# Altium schematic sheet Fonte_Sim_Bat.SchDoc
size A4; Author: Vitor Costa; DrawnBy: Vitor Costa
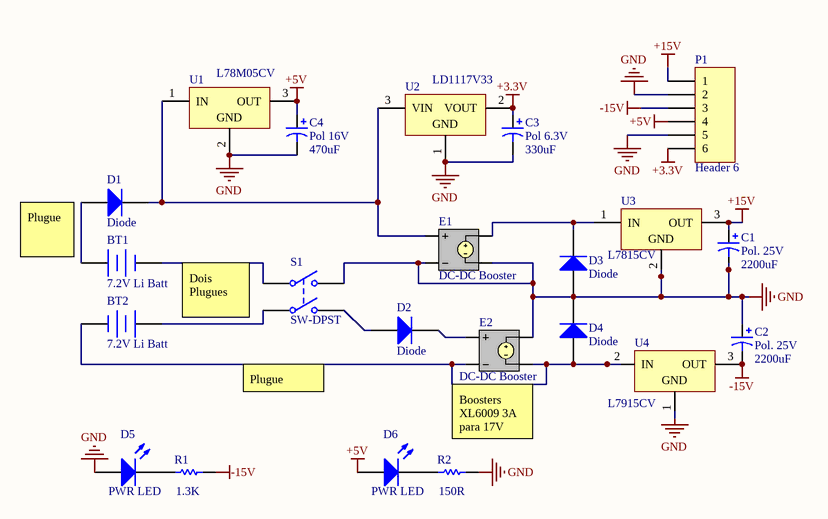
[diagram p0: Fonte_Sim_Bat.SchDoc]

## Parts
BT1  7.2V Li Batt  [BAT-2]
BT2  7.2V Li Batt  [BAT-2]
C1  Pol. 25V  value 2200uF  [RB7.6-15]
C2  Pol. 25V  value 2200uF  [RB7.6-15]
C3  Pol 6.3V  value 330uF  [RB7.6-15]
C4  Pol 16V  value 470uF  [RB7.6-15]
D1  Diode  [SMC]
D2  Diode  [SMC]
D3  Diode  [SMC]
D4  Diode  [SMC]
D5  PWR LED  [3.5X2.8X1.9]
D6  PWR LED  [3.5X2.8X1.9]
E1  DC-DC Booster
E2  DC-DC Booster
P1  Header 6  [HDR1X6]
R1  value 1.3K  [AXIAL-0.3]
R2  value 150R  [AXIAL-0.3]
S1  SW-DPST  [DPST-4]
U1  L78M05CV  [TO220]
U2  LD1117V33  [TO220]
U3  L7815CV  [TO220]
U4  L7915CV  [TO-220]

## Nets
+3.3V: C3.1 P1.6 U2.2(VOUT)
+5V: C4.1 D6.1(A) P1.4 U1.3(OUT)
+15V: C1.1 P1.1 U3.3(OUT)
-15V: C2.2 P1.3 R1.2 U4.3(OUT)
GND: C1.2 C2.1 C3.2 C4.2 D3.1(A) D4.2(K) D5.1(A) E1.2(NC-) E1.4(N-) E2.3(N+) P1.2 P1.5 R2.2 S1.2(NO1) U1.2(GND) U2.1(GND) U3.2(GND) U4.1(GND)
NetBT1_1: BT1.1(+) D1.1(A)
NetBT1_2: BT1.2(-) S1.1(COMMON1)
NetBT2_1: BT2.1(+) S1.3(COMMON2)
NetBT2_2: BT2.2(-) D4.1(A) E2.2(NC-) E2.4(N-) U4.2(IN)
NetD1_2: D1.2(K) E1.1(NC+) U1.1(IN) U2.3(VIN)
NetD2_1: D2.1(A) S1.4(NO2)
NetD2_2: D2.2(K) E2.1(NC+)
NetD3_2: D3.2(K) E1.3(N+) U3.1(IN)
NetD5_2: D5.2(K) R1.1
NetD6_2: D6.2(K) R2.1

## Notes on the sheet
- Plugue
- Dois Plugues
- Boosters XL6009 3A para 17V

## Library data of the parts
BT1 BT2 = Battery: Multicell Battery; Published: 24-Mar-1999; LatestRevisionDate: 17-Jul-2002; LatestRevisionNote: Re-released for DXP Platform.; PackageReference: BAT-2; Publisher: Altium Limited; PackageDescription: Battery; 2 Leads
C1-C4 = Cap Pol1: Polarized Capacitor (Radial); Published: 8-Jun-2000; LatestRevisionDate: 17-Jul-2002; LatestRevisionNote: Re-released for DXP Platform.; PackageReference: RB7.6-15; Publisher: Altium Limited; PackageDescription: Polarized Capacitor (Radial); 2 Leads
D1 D2 = Diode: 2A or greater, to prevent reverse polarity; Published: 8-Jun-2000; LatestRevisionDate: 17-Jul-2002; LatestRevisionNote: Re-released for DXP Platform.; PackageVersion: Sep-1996; PackageReference: SMC; Publisher: Altium Limited; PackageDescription: DO-214-AB/SMC; 2 C-Bend Leads; Body 7.9 x 5.9 mm, inc. leads (LxW); Code_JEDEC: DO-214-AB
D3 D4 = Diode: Flywheel; Published: 8-Jun-2000; LatestRevisionDate: 17-Jul-2002; LatestRevisionNote: Re-released for DXP Platform.; PackageVersion: Sep-1996; PackageReference: SMC; Publisher: Altium Limited; PackageDescription: DO-214-AB/SMC; 2 C-Bend Leads; Body 7.9 x 5.9 mm, inc. leads (LxW); Code_JEDEC: DO-214-AB
D5 D6 = LED3: Typical BLUE SiC LED; Published: 8-Jun-2000; LatestRevisionDate: 17-Dec-2003; LatestRevisionNote: PCB Footprint replaced.; DatasheetVersion: 16-Apr-2002; PackageVersion: 16-Apr-2002; PackageReference: 3.5X2.8X1.9; Publisher: Altium Limited; PackageDescription: SM LED; 2 C-Bend Leads; Body 3.5 x 2.8 x 1.9 mm, inc leads (LxWxH typ)
E1 E2 = ESRC: Voltage Controlled Voltage Source; Note: PCB Footprint - Not required; Sim Note: Enter gain into gain field; Published: 8-Jun-2000; LatestRevisionDate: 17-Jul-2002; LatestRevisionNote: Re-released for DXP Platform.; PackageReference: Not Applicable; Publisher: Altium Limited
P1 = Header 6: Header, 6-Pin; LatestRevisionDate: 17-Jul-2002; LatestRevisionNote: Re-released for DXP Platform.; Publisher: Altium Limited
R1 R2 = Res1: Resistor; Published: 8-Jun-2000; LatestRevisionDate: 17-Jul-2002; LatestRevisionNote: Re-released for DXP Platform.; PackageReference: AXIAL-0.3; Publisher: Altium Limited; PackageDescription: Axial Device, Thru-Hole; 2 Leads; 0.3 in Pin Spacing
S1 = SW-DPST: Double-Pole, Single-Throw Switch; Published: 24-Mar-1999; LatestRevisionDate: 17-Jul-2002; LatestRevisionNote: Re-released for DXP Platform.; PackageReference: DPST-4; Publisher: Altium Limited; PackageDescription: Switch; 4 Leads
U1 = L78M05CV: Positive Voltage Regulator, 5V, 3-Pin TO-220; DatasheetVersion: Nov-2010; PackageVersion: ver3.0; PackageReference: TO220; PackageDescription: TO, Thru-Hole, Vertical, Heatsink Mounted; 3 In-Line Leads; Pitch 2.54 mm; PartNumber: L78M05CV; ComponentLink1Description: Manufacturer URL; ComponentLink1URL: http://www.st.com; ComponentLink2Description: Datasheet; ComponentLink2URL: http://www.st.com/internet/com/TECHNICAL_RESOURCES/TECHNICAL_LITERATURE/DATASHEET/CD00000447.pdf; ComponentLink3Description: Package Specification; ComponentLink3URL: http://www.st.com/internet/com/TECHNICAL_RESOURCES/TECHNICAL_LITERATURE/PACKAGE_INFORMATION/CD00004649.pdf
U2 = LD1117V33: Fixed Low Drop Positive Voltage Regulator, 3.3V, 3-Pin TO-220; DatasheetVersion: Nov-2011; PackageVersion: ver3.0; PackageReference: TO220; PackageDescription: TO, Thru-Hole, Vertical, Heatsink Mounted; 3 In-Line Leads; Pitch 2.54 mm; PartNumber: LD1117V33; ComponentLink1Description: Manufacturer URL; ComponentLink1URL: http://www.st.com; ComponentLink2Description: Datasheet; ComponentLink2URL: http://www.st.com/internet/com/TECHNICAL_RESOURCES/TECHNICAL_LITERATURE/DATASHEET/CD00000544.pdf; ComponentLink3Description: Package Specification; ComponentLink3URL: http://www.st.com/internet/com/TECHNICAL_RESOURCES/TECHNICAL_LITERATURE/PACKAGE_INFORMATION/CD00004649.pdf
U3 = L7815CV: Positive Voltage Regulator, 15V, 3-Pin TO-220; DatasheetVersion: Nov-2011; PackageVersion: ver3.0; PackageReference: TO220; PackageDescription: TO, Thru-Hole, Vertical, Heatsink Mounted; 3 In-Line Leads; Pitch 2.54 mm; PartNumber: L7815CV; ComponentLink1Description: Manufacturer URL; ComponentLink1URL: http://www.st.com; ComponentLink2Description: Datasheet; ComponentLink2URL: http://www.st.com/internet/com/TECHNICAL_RESOURCES/TECHNICAL_LITERATURE/DATASHEET/CD00000444.pdf; ComponentLink3Description: Package Specification; ComponentLink3URL: http://www.st.com/internet/com/TECHNICAL_RESOURCES/TECHNICAL_LITERATURE/PACKAGE_INFORMATION/CD00004649.pdf
U4 = L7915CV: Negative Voltage Regulator, -15V, 3-Pin D2PAK; DatasheetVersion: Nov-2011; PackageVersion: 2011; PackageReference: TO-220; PackageDescription: TO, Thru-Hole, Vertical, Heatsink Mounted; 3 In-Line Leads; Pitch 2.54 mm; PartNumber: L7915CV; ComponentLink1Description: Manufacturer URL; ComponentLink1URL: http://www.st.com; ComponentLink2Description: Datasheet; ComponentLink2URL: http://www.st.com/internet/com/TECHNICAL_RESOURCES/TECHNICAL_LITERATURE/DATASHEET/CD00000450.pdf